# EAGLE design camera-ir-led (EAGLE 7.7.0)
CREVISION: 1A; DESIGNER: Joo Aun Saw
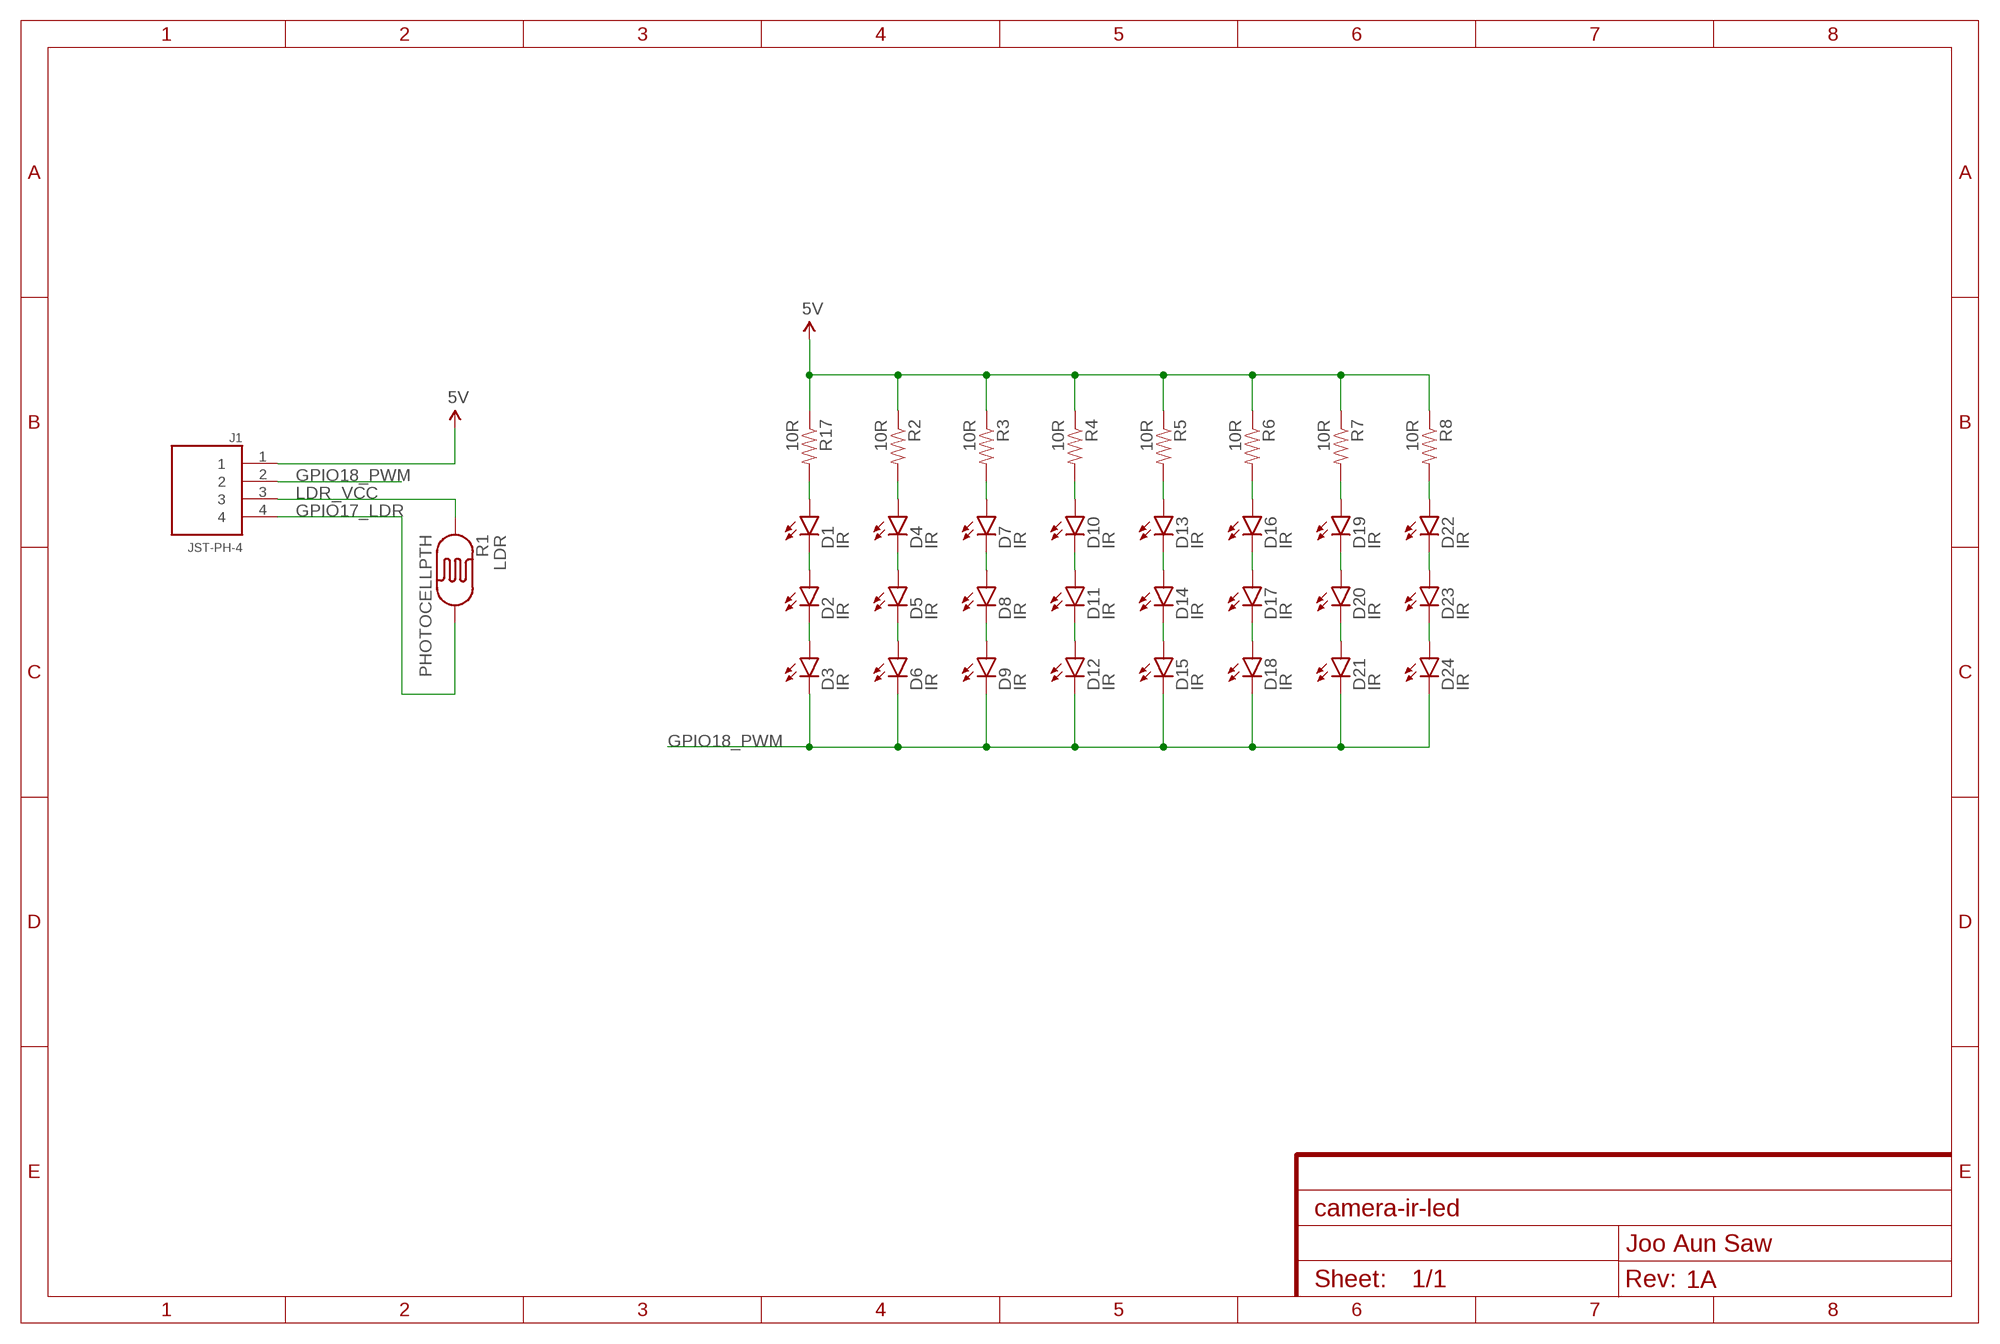
[diagram p0: schematic, sheet 1]

## Parts
D1  IR  LED5MM  [LED5MM]
D2  IR  LED5MM  [LED5MM]
D3  IR  LED5MM  [LED5MM]
D4  IR  LED5MM  [LED5MM]
D5  IR  LED5MM  [LED5MM]
D6  IR  LED5MM  [LED5MM]
D7  IR  LED5MM  [LED5MM]
D8  IR  LED5MM  [LED5MM]
D9  IR  LED5MM  [LED5MM]
D10  IR  LED5MM  [LED5MM]
D11  IR  LED5MM  [LED5MM]
D12  IR  LED5MM  [LED5MM]
D13  IR  LED5MM  [LED5MM]
D14  IR  LED5MM  [LED5MM]
D15  IR  LED5MM  [LED5MM]
D16  IR  LED5MM  [LED5MM]
D17  IR  LED5MM  [LED5MM]
D18  IR  LED5MM  [LED5MM]
D19  IR  LED5MM  [LED5MM]
D20  IR  LED5MM  [LED5MM]
D21  IR  LED5MM  [LED5MM]
D22  IR  LED5MM  [LED5MM]
D23  IR  LED5MM  [LED5MM]
D24  IR  LED5MM  [LED5MM]
J1  JST-PH-4  CONNECTOR-4-POS-THJST-PH-4  [JST-PH-4-POS-TH]
R1  PHOTOCELLPTH  [PHOTOCELL]
R2  10R  RESISTOR0805-RES  [0805]
R3  10R  RESISTOR0805-RES  [0805]
R4  10R  RESISTOR0805-RES  [0805]
R5  10R  RESISTOR0805-RES  [0805]
R6  10R  RESISTOR0805-RES  [0805]
R7  10R  RESISTOR0805-RES  [0805]
R8  10R  RESISTOR0805-RES  [0805]
R17  10R  RESISTOR0805-RES  [0805]

## Nets
5V: J1.1 R2.1 R3.1 R4.1 R5.1 R6.1 R7.1 R8.1 R17.1
GPIO17_LDR: J1.4 R1.2
GPIO18_PWM: D3.K(C) D6.K(C) D9.K(C) D12.K(C) D15.K(C) D18.K(C) D21.K(C) D24.K(C) J1.2
LDR_VCC: J1.3 R1.1
N$1: D2.K(C) D3.A
N$2: D1.K(C) D2.A
N$3: D1.A R17.2
N$4: D5.K(C) D6.A
N$5: D4.K(C) D5.A
N$6: D4.A R2.2
N$7: D8.K(C) D9.A
N$8: D7.K(C) D8.A
N$9: D7.A R3.2
N$10: D11.K(C) D12.A
N$11: D10.K(C) D11.A
N$12: D10.A R4.2
N$13: D14.K(C) D15.A
N$14: D13.K(C) D14.A
N$15: D13.A R5.2
N$16: D17.K(C) D18.A
N$17: D16.K(C) D17.A
N$18: D16.A R6.2
N$20: D20.K(C) D21.A
N$21: D19.K(C) D20.A
N$22: D19.A R7.2
N$23: D23.K(C) D24.A
N$24: D22.K(C) D23.A
N$25: D22.A R8.2

## Library data of the parts
D1-D24 = custom:LED: LEDs Standard schematic elements and footprints for 5mm, 3mm, 1206, and 0603 sized LEDs. 5mm - Spark Fun Electronics SKU : COM-00529 (and others)
J1 = custom:CONNECTOR-4-POS-TH
R1 = SparkFun-Sensors:PHOTOCELL: CdS photoresistor. This is a low cost way to detect light levels. Resistance decreases with more incoming light. SparkFun SKU: SEN-09088; LDR: 1; PARTNO: GL5528
R2-R8 R17 = SparkFun-Passives:RESISTOR: Resistor Basic schematic elements and footprints for 0603, 1206, and PTH resistors.; DIGIKEY: 311-10ARCT-ND; MOUSER: 603-RC0805JR-0710RL; PARTNO: RC0805JR-0710RL

## Board
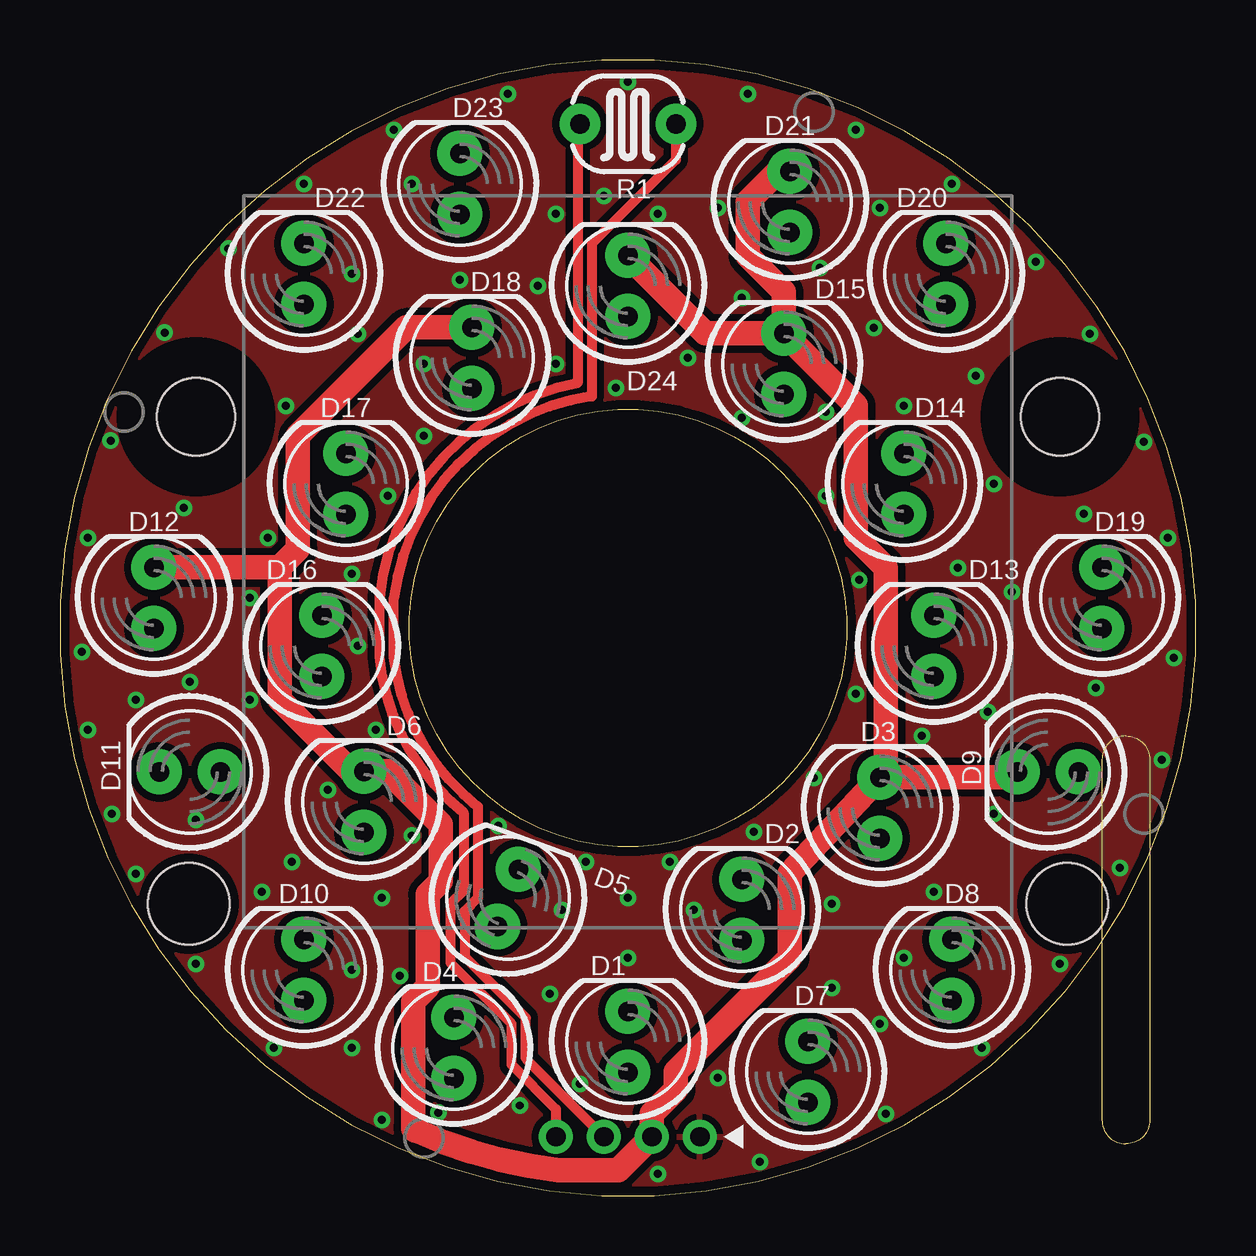
[diagram p1: board, top side]
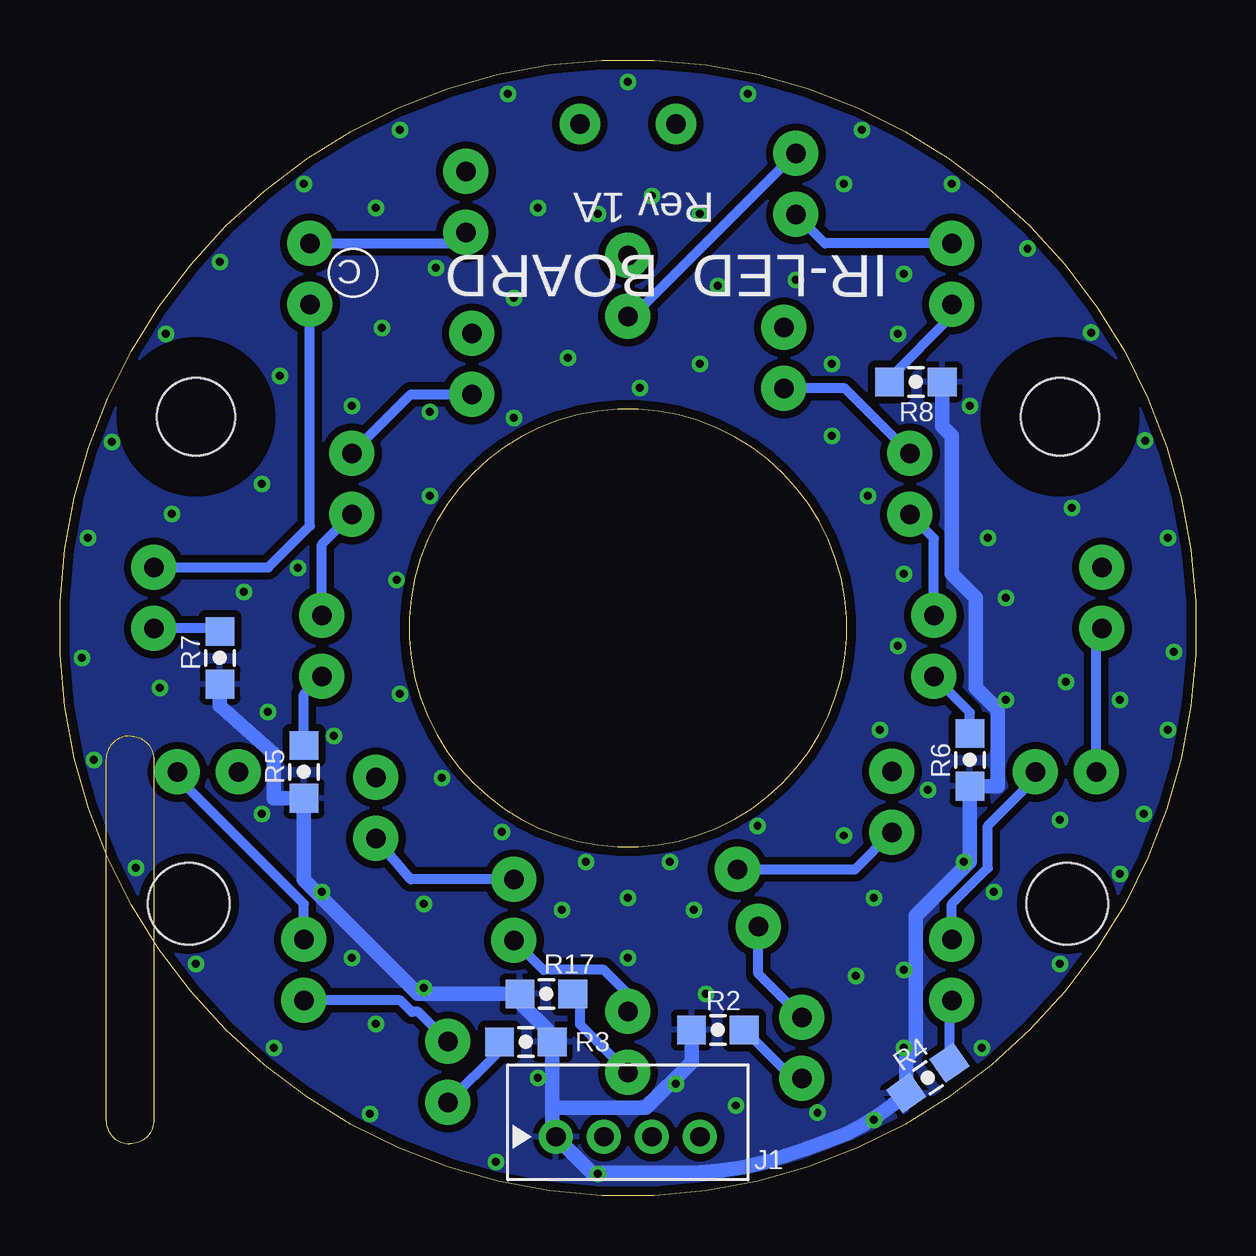
[diagram p2: board, bottom side, seen from below]

Size 47.33 x 47.33 mm. Coordinates in mm from the lower left corner, seen from the top.
Outline: 6.91,6.91 arc90 40.41,6.91 arc90 40.41,40.41 arc90 6.91,40.41 arc90 6.91,6.91
Outline: 17.21,30.11 arc-90 30.11,30.11 arc-90 30.11,17.21 arc-90 17.21,17.21 arc-90 17.21,30.11
Copper layers (1*16): Top 0.0356mm / dielectric 1.5011mm / Bottom 0.0356mm
Design rules "oshpark-2layer *": minimum track width 6mil, minimum drill 13mil, track to track 6mil, track to pad 6mil, pad to pad 6mil, via to via 6mil, smd to smd 6mil, copper to edge 15mil, drill to drill 6mil, minimum pad ring 7mil, minimum via ring 7mil, stop-mask expansion 2mil, vias tented up to drill 100mil, thermal gap 10mil
Holes 3.4 mm at 5.36,12.16 41.96,12.16
Holes 3.25 mm at 5.66,32.46 41.66,32.46
tRestrict: area 2.7,29.5 to 8.7,35.5; area 38.7,29.5 to 44.7,35.5
bRestrict: area 2.7,29.5 to 8.7,35.5; area 38.7,29.5 to 44.7,35.5
Milling: 6 lines

### Footprints (pad centres in the part's own frame; a part is rotated, then mirrored left to right if it is on the bottom)
LED5MM = drill 0.813 pad 1.88: A -1.27,0; K 1.27,0
JST-PH-4-POS-TH = drill 0.8 pad 1.422: 1 -3,0; 2 -1,0; 3 1,0; 4 3,0
PHOTOCELL = drill 0.8 pad 1.676: 1 -2,0; 2 2,0
0805 = smd 1.2 x 1.2: 1 -1.1,0; 2 1.1,0

### Placement (x,y rotation side)
D1  23.66,6.41 90 top
D2  28.41,11.91 90 top
D3  34.16,16.16 90 top
D4  16.41,6.16 90 top
D5  18.66,12.41 70 top
D6  12.66,16.41 90 top
D7  31.16,5.16 90 top
D8  37.16,9.41 90 top
D9  41.16,17.66 180 top
D10  10.16,9.41 90 top
D11  5.41,17.66 180 top
D12  3.91,24.91 90 top
D13  36.41,22.91 90 top
D14  35.16,29.66 90 top
D15  30.16,34.66 90 top
D16  10.91,22.91 90 top
D17  11.91,29.66 90 top
D18  17.16,34.91 90 top
D19  43.41,24.91 90 top
D20  36.91,38.41 90 top
D21  30.41,41.41 90 top
D22  10.16,38.41 90 top
D23  16.66,42.16 90 top
D24  23.66,37.91 90 top
J1  23.66,2.46 0 bottom
R1  23.66,44.66 180 top
R2  19.91,6.91 0 bottom
R3  27.91,6.41 180 bottom
R4  11.16,4.91 35 bottom
R5  37.16,17.66 90 bottom
R6  9.41,18.16 90 bottom
R7  40.66,22.41 90 bottom
R8  11.66,33.91 180 bottom
R17  27.06,8.41 0 bottom

### Tracks (layer width: path | path; a pad name or v marks a point on that pad's centre or on a via)
5V  (via drill 0.33)
  Bottom 0.61: 26.81,3.66 R3.1 26.81,6.71 28.16,8.06 R17.1 32.41,8.41 37.16,13.16 R5.1 38.41,16.56 38.41,18.41 40.66,20.41 R7.1 | 26.81,3.66 22.91,3.66 21.01,5.56 R2.1 | R8.1 10.56,32.06 10.16,31.66 10.16,25.91 9.16,24.91 9.16,21.16 8.26,20.26 8.26,17.06 R6.1 9.41,13.91 11.66,11.66 11.66,6.16 12.06,5.76 R4.1 arc17 14.51,2.61 arc4 17.11,1.66 arc20 21.51,0.96 25.16,0.96 J1.1 26.81,2.61 26.81,3.66
  other vias: 29.16,1.41 15.76,3.46 24.91,0.91 34.41,3.41 13.41,3.16 27.41,4.91 20.41,8.41 18.26,15.41 21.91,13.91 28.91,15.16 23.66,9.91 20.91,11.91 26.41,11.91 33.16,20.91 31.41,17.41 25.41,13.91 33.3,25.66 41.66,9.66 38.41,6.16 34.16,7.16 44.16,13.66 32.16,12.16 32.16,8.66 36.41,12.66 38.91,15.91 35.91,19.16 38.66,20.16 45.91,18.16 46.41,22.41 43.16,21.16 39.66,25.16 37.41,26.16 46.16,27.41 45.16,31.41 42.66,28.41 38.91,29.66 31.91,29.16 42.91,35.91 38.16,34.16 35.16,32.91 40.66,38.91 31.66,38.66 33.91,36.16 37.16,42.16 33.16,44.41 34.16,41.16 28.41,37.41 24.91,40.91 28.66,45.91 23.66,46.41 18.66,45.91 13.91,44.41 22.66,41.66 20.66,40.91 23.16,33.66 28.41,32.41 26.16,34.91 31.91,32.66 20.66,34.66 19.91,37.91 16.66,38.16 15.16,34.66 15.16,31.66 2.11,31.46 4.36,35.96 12.16,25.91 13.66,29.16 12.41,22.91 7.91,24.91 7.91,20.66 13.16,19.41 14.66,15.01 11.16,16.91 9.66,13.91 12.16,9.41 14.16,9.16 13.41,12.41 12.16,6.16 5.66,9.66 8.91,6.16 3.16,13.41 8.41,12.66 5.66,15.66 2.16,15.91 0.91,22.66 3.16,20.66 5.41,21.41 1.16,27.41 8.66,27.41 5.16,28.66 9.41,32.91 12.41,35.91 12.16,38.41 10.16,42.16 7.01,39.46 14.66,42.16 1.16,19.41 21.66,4.66 23.66,12.41 35.16,9.91 27.41,41.16 19.16,3.76
  pour Bottom (isolate 0.305): 23.66,47.36 arc90 -0.04,23.66 arc90 23.66,-0.04 arc90 47.36,23.66 arc90
  pour Top (isolate 0.305): 23.66,47.36 arc90 -0.04,23.66 arc90 23.66,-0.04 arc90 47.36,23.66 arc90
GPIO17_LDR
  Top 0.406: R1.2 21.56,44.56 21.56,33.86 arc73 13.31,24.96 13.31,22.46 arc45 16.81,15.96 16.81,12.71 16.26,12.16 16.26,9.71 18.81,7.16 18.81,5.46 20.66,3.61 J1.4
GPIO18_PWM
  Top 1.016: D21.K 29.93,42.68 28.66,41.41 28.66,39.16 30.16,37.66 D15.K | D15.K 33.16,32.93 33.16,27.41 34.41,26.16 34.41,17.43 D3.K | D9.K 39.66,17.43 D3.K | D3.K 30.41,13.43 30.41,9.91 25.66,5.16 25.66,4.41 24.66,3.41 J1.2 23.26,1.06 20.76,1.06 arc-18 14.86,2.71 arc-90 14.71,2.86 14.71,8.11 15.31,8.71 15.31,12.56 15.86,13.11 15.86,15.48 13.66,17.68 D6.K 12.39,17.43 9.16,20.66 9.16,26.18 | D18.K 14.43,36.18 9.91,31.66 9.91,26.93 9.16,26.18 | D12.K 9.16,26.18 | D24.K 23.66,39.16 26.89,35.93 D15.K
LDR_VCC
  Top 0.406: R1.1 25.66,43.16 22.16,39.66 22.16,33.31 arc75 13.91,24.91 13.91,22.46 arc45 17.41,16.21 17.41,12.41 16.86,11.86 16.86,9.96 19.41,7.41 19.41,5.71 J1.3
N$1
  Bottom 0.406: D2.K 32.7,13.18 D3.A
N$2
  Bottom 0.406: D1.K 23.66,8.41 24.66,9.41 27.18,9.41 D2.A
N$3
  Bottom 0.406: R17.2 25.66,8.11 25.66,7.14 D1.A
N$4
  Bottom 0.406: D5.K 14.2,13.61 D6.A
N$5
  Bottom 0.406: D4.K 18.23,9.25 D5.A
N$6
  Bottom 0.406: R2.2 16.79,4.89 D4.A
N$7
  Bottom 0.406: D8.K 37.16,12.16 42.43,17.43 D9.A
N$8
  Bottom 0.406: D7.K 32.39,7.66 32.66,7.66 33.14,8.14 D8.A
N$9
  Bottom 0.406: R3.2 29.01,6.04 D7.A
N$10
  Bottom 0.406: D11.K 4.14,23.41 D12.A
N$11
  Bottom 0.406: D10.K 10.16,12.16 8.66,13.66 8.66,15.41 6.68,17.39 D11.A
N$12
  Bottom 0.406: R4.2 10.26,8.04 D10.A
N$13
  Bottom 0.406: D14.K 32.7,33.39 D15.A
N$14
  Bottom 0.406: D13.K 36.41,27.14 D14.A
N$15
  Bottom 0.406: R5.2 37.16,20.89 D13.A
N$16
  Bottom 0.406: D17.K 14.62,33.64 D18.A
N$17
  Bottom 0.406: D16.K 10.91,27.39 D17.A
N$18
  Bottom 0.406: R6.2 9.41,20.14 D16.A
N$20
  Bottom 0.406: D20.K 30.87,39.68 D21.A
N$21
  Bottom 0.406: D19.K 38.64,26.18 36.91,27.91 D20.A
N$22
  Bottom 0.406: R7.2 40.79,23.64 D19.A
N$23
  Bottom 0.406: D23.K 23.45,36.64 D24.A
N$24
  Bottom 0.406: D22.K 15.45,39.68 D23.A
N$25
  Bottom 0.406: R8.2 12.76,34.06 10.16,36.66 D22.A
N$26
  cutout Bottom (isolate 0.305): 23.66,32.81 arc90 14.51,23.66 arc90 23.66,14.51 arc90 32.81,23.66 arc90
  cutout Top (isolate 0.305): 23.66,32.81 arc90 14.51,23.66 arc90 23.66,14.51 arc90 32.81,23.66 arc90

### Text on the board
bPlace: Rev 1A | IR-LED BOARD | C